# Altium schematic sheet Strain-TI.SchDoc
size 297 x 209 mm; SheetNumber: 4; SheetTotal: 4; SheetTitle: Strain Gauge Frontend
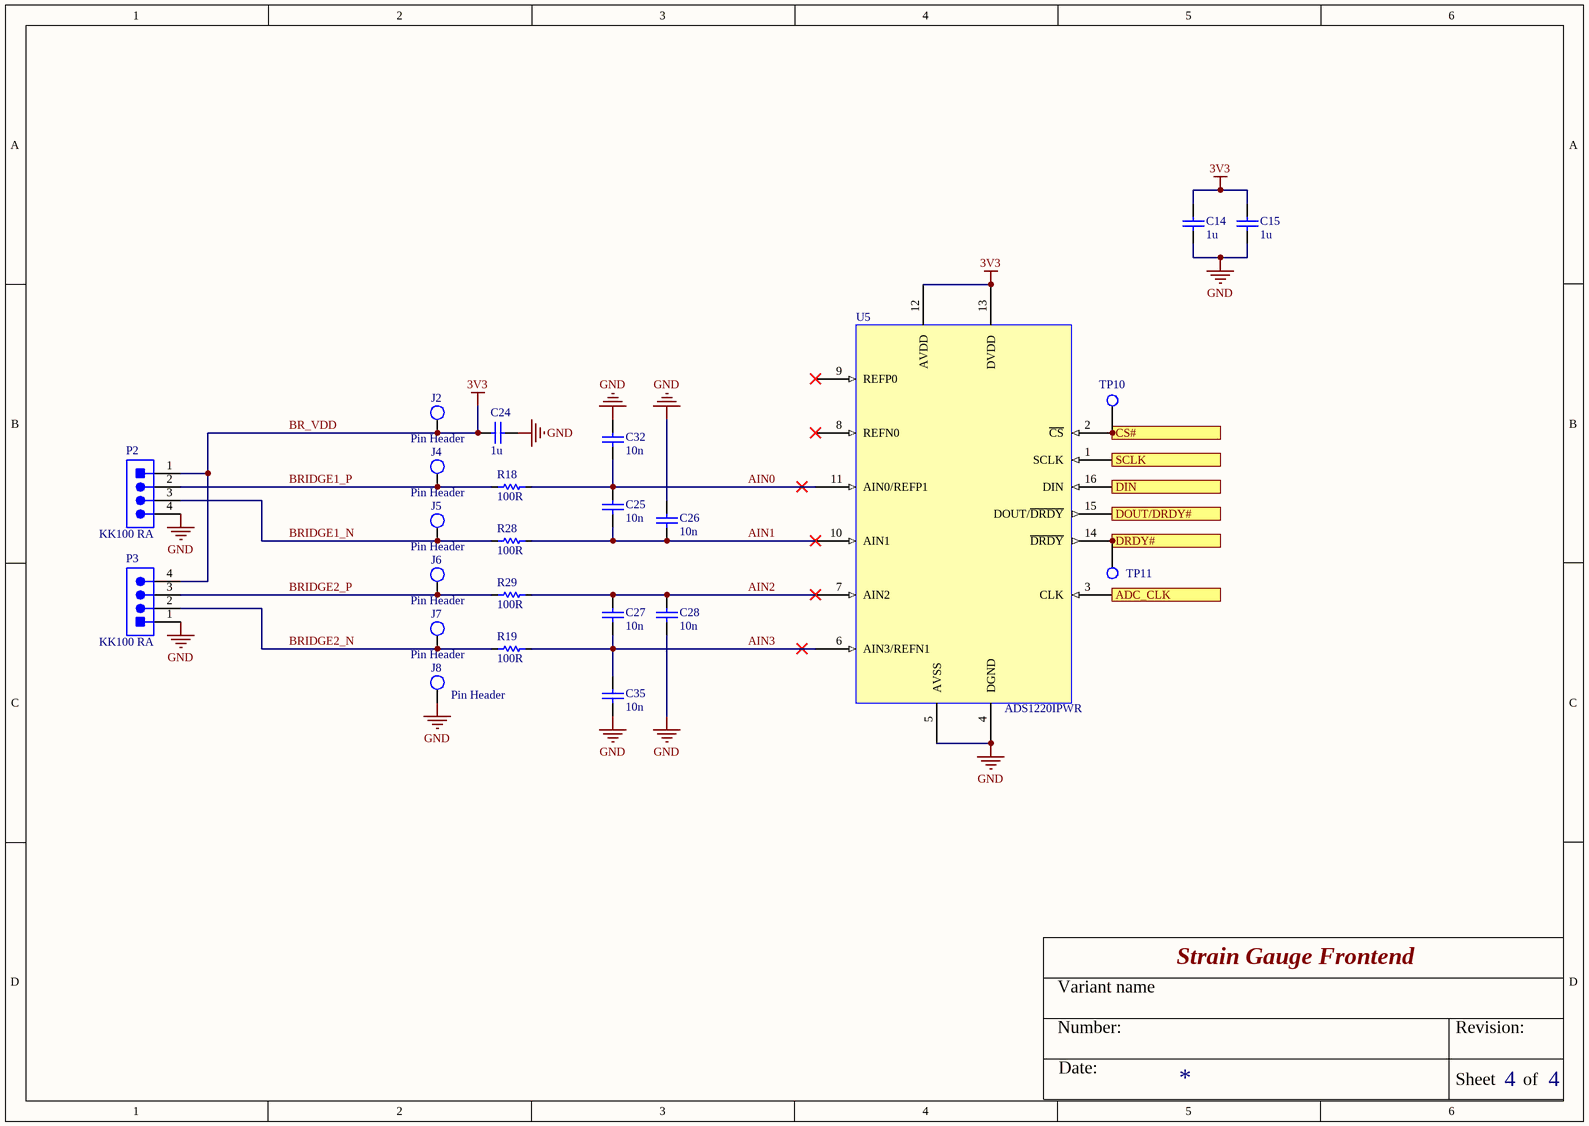
[diagram p0: Strain-TI.SchDoc]

## Parts
C14  1u  [CAP_0603_M]
C15  1u  [CAP_0603_M]
C24  1u  [CAP_0603_M]
C25  10n  [CAP_0603_M]
C26  10n  [CAP_0603_M]
C27  10n  [CAP_0603_M]
C28  10n  [CAP_0603_M]
C32  10n  [CAP_0603_M]
C35  10n  [CAP_0603_M]
J2  Pin Header  [PIN_HEADER_1POS]
J4  Pin Header  [PIN_HEADER_1POS]
J5  Pin Header  [PIN_HEADER_1POS]
J6  Pin Header  [PIN_HEADER_1POS]
J7  Pin Header  [PIN_HEADER_1POS]
J8  Pin Header  [PIN_HEADER_1POS]
P2  KK100 RA  [MOLEX_KK100_RA_4P]
P3  KK100 RA  [MOLEX_KK100_RA_4P]
R18  100R  [RES_0603_M]
R19  100R  [RES_0603_M]
R28  100R  [RES_0603_M]
R29  100R  [RES_0603_M]
TP10  TP-1.5mm  [TP-1.5mm]  (value not drawn)
TP11  TP-1.5mm  [TP-1.5mm]  (value not drawn)
U5  ADS1220IPWR  [TI_PW_SOP127P600-8N]

## Ports
ADC_CLK (in), CS# (in), DIN (in), DOUT/DRDY# (out), DRDY# (out), SCLK (in)

## Nets
BR_VDD: C14.2 C15.2 C24.1 J2.1 P2.1 P3.4 U5.12(AVDD) U5.13(DVDD)  [also labelled 3V3]
GND: C14.1 C15.1 C24.2 C26.2 C28.2 C32.2 C35.1 J8.1 P2.4 P3.1 U5.4(DGND) U5.5(AVSS)
ADC_CLK: U5.3(CLK) ; port ADC_CLK
AIN0: C25.2 C32.1 R18.2 U5.11(AIN0/REFP1)
AIN1: C25.1 C26.1 R28.2 U5.10(AIN1)
AIN2: C27.2 C28.1 R29.2 U5.7(AIN2)
AIN3: C27.1 C35.2 R19.2 U5.6(AIN3/REFN1)
BRIDGE1_N: J5.1 P2.3 R28.1
BRIDGE1_P: J4.1 P2.2 R18.1
BRIDGE2_N: J7.1 P3.2 R19.1
BRIDGE2_P: J6.1 P3.3 R29.1
CS#: TP10.1 U5.2(~{CS}) ; port CS#
DIN: U5.16(DIN) ; port DIN
DOUT/DRDY#: U5.15(DOUT/~{DRDY}) ; port DOUT/DRDY#
DRDY#: TP11.1 U5.14(~{DRDY}) ; port DRDY#
SCLK: U5.1(SCLK) ; port SCLK

Not connected (* = marked no-connect by the designer): U5 8(REFN0)* 9(REFP0)*

## Notes on the sheet
- Variant name
- Number:
- Date:
- Revision:
- Sheet
- of

## Library data of the parts
C14 C15 C24 = CAP_0603: CAP 1uF 6.3V 20% X7R 0603; Category: capacitor; Created: 2018-07-01; Created By: JS; Last Modified: 2018-07-01
C25-C28 C32 C35 = CAP_0603: CAP 10nF 6.3V 20% X7R 0603; Category: capacitor; Created: 2018-07-01; Created By: JS; Last Modified: 2018-07-01
J2 J4-J8 = PIN_HEADER_1POS: Pin Header 0.1" 1pos
P2 P3 = MOLEX_KK100_RA_4P: Right angle rectangular connector, KK100, 4pos; Manufacturer: Molex; Manufacturer PN: 0022053041
R18 R19 R28 R29 = RES_0603: RES 100R 1/5W 0603; Manufacturer: *; Manufacturer PN: *; Category: resistor; Created: 2018-07-01; Last Modified: 2018-07-01; Created By: JS
TP10 TP11 = TP-1.5mm: Test Point; PCB_Label: ADC_CLK
U5 = TI_ADS1220IPWR: ADS1220 4-Channel, 2-kSPS, Low-Power, 24-Bit ADC with Integrated PGA and Reference; Manufacturer: TI; Manufacturer PN: ADS1220IPWR